# Altium schematic sheet 25632-myersd33_02_7459.SchDoc: MSP430 Booster Pack
size B; Date: Not shown in title block; ApprovedBy: Not shown in title block; CheckedBy: Not shown in title block; Author: Not shown in title block; CompanyName: Not shown in title block; Engineer: Logan Greif; Organization: Not shown in title block; Address1: Not shown in title block; Address2: Not shown in title block; Address3: Not shown in title block; Address4: Not shown in title block; DocumentNumber: 1; Revision: Use project parameter SCH_Rev; SheetNumber: 1; SheetTotal: 2; PageSetup: Record=PageOptions|CenterHorizontal=True|CenterVertical=True|PrintScale=1.00|XCorrection=1.00|YCorrection=1.00|PrintKind=0|BorderSize=5000000|LeftOffset=0|BottomOffset=0|Orientation=2|PaperLength=1000|PaperWidth=1000|Scale=100|PaperSource=15|PrintQuality=600|MediaType=1|DitherType=10|PaperKind=Letter|PrintScaleMode=1; SPICEModelCacheLYYKNJCK: <root> / <DocumentId>LYYKNJCK</DocumentId> / </root>; CurrentTime: Not shown in title block; CurrentDate: Not shown in title block; Time: Not shown in title block; DocumentFullPathAndName: Not shown in title block; DocumentName: Not shown in title block; ModifiedDate: Not shown in title block; ImagePath: Not shown in title block
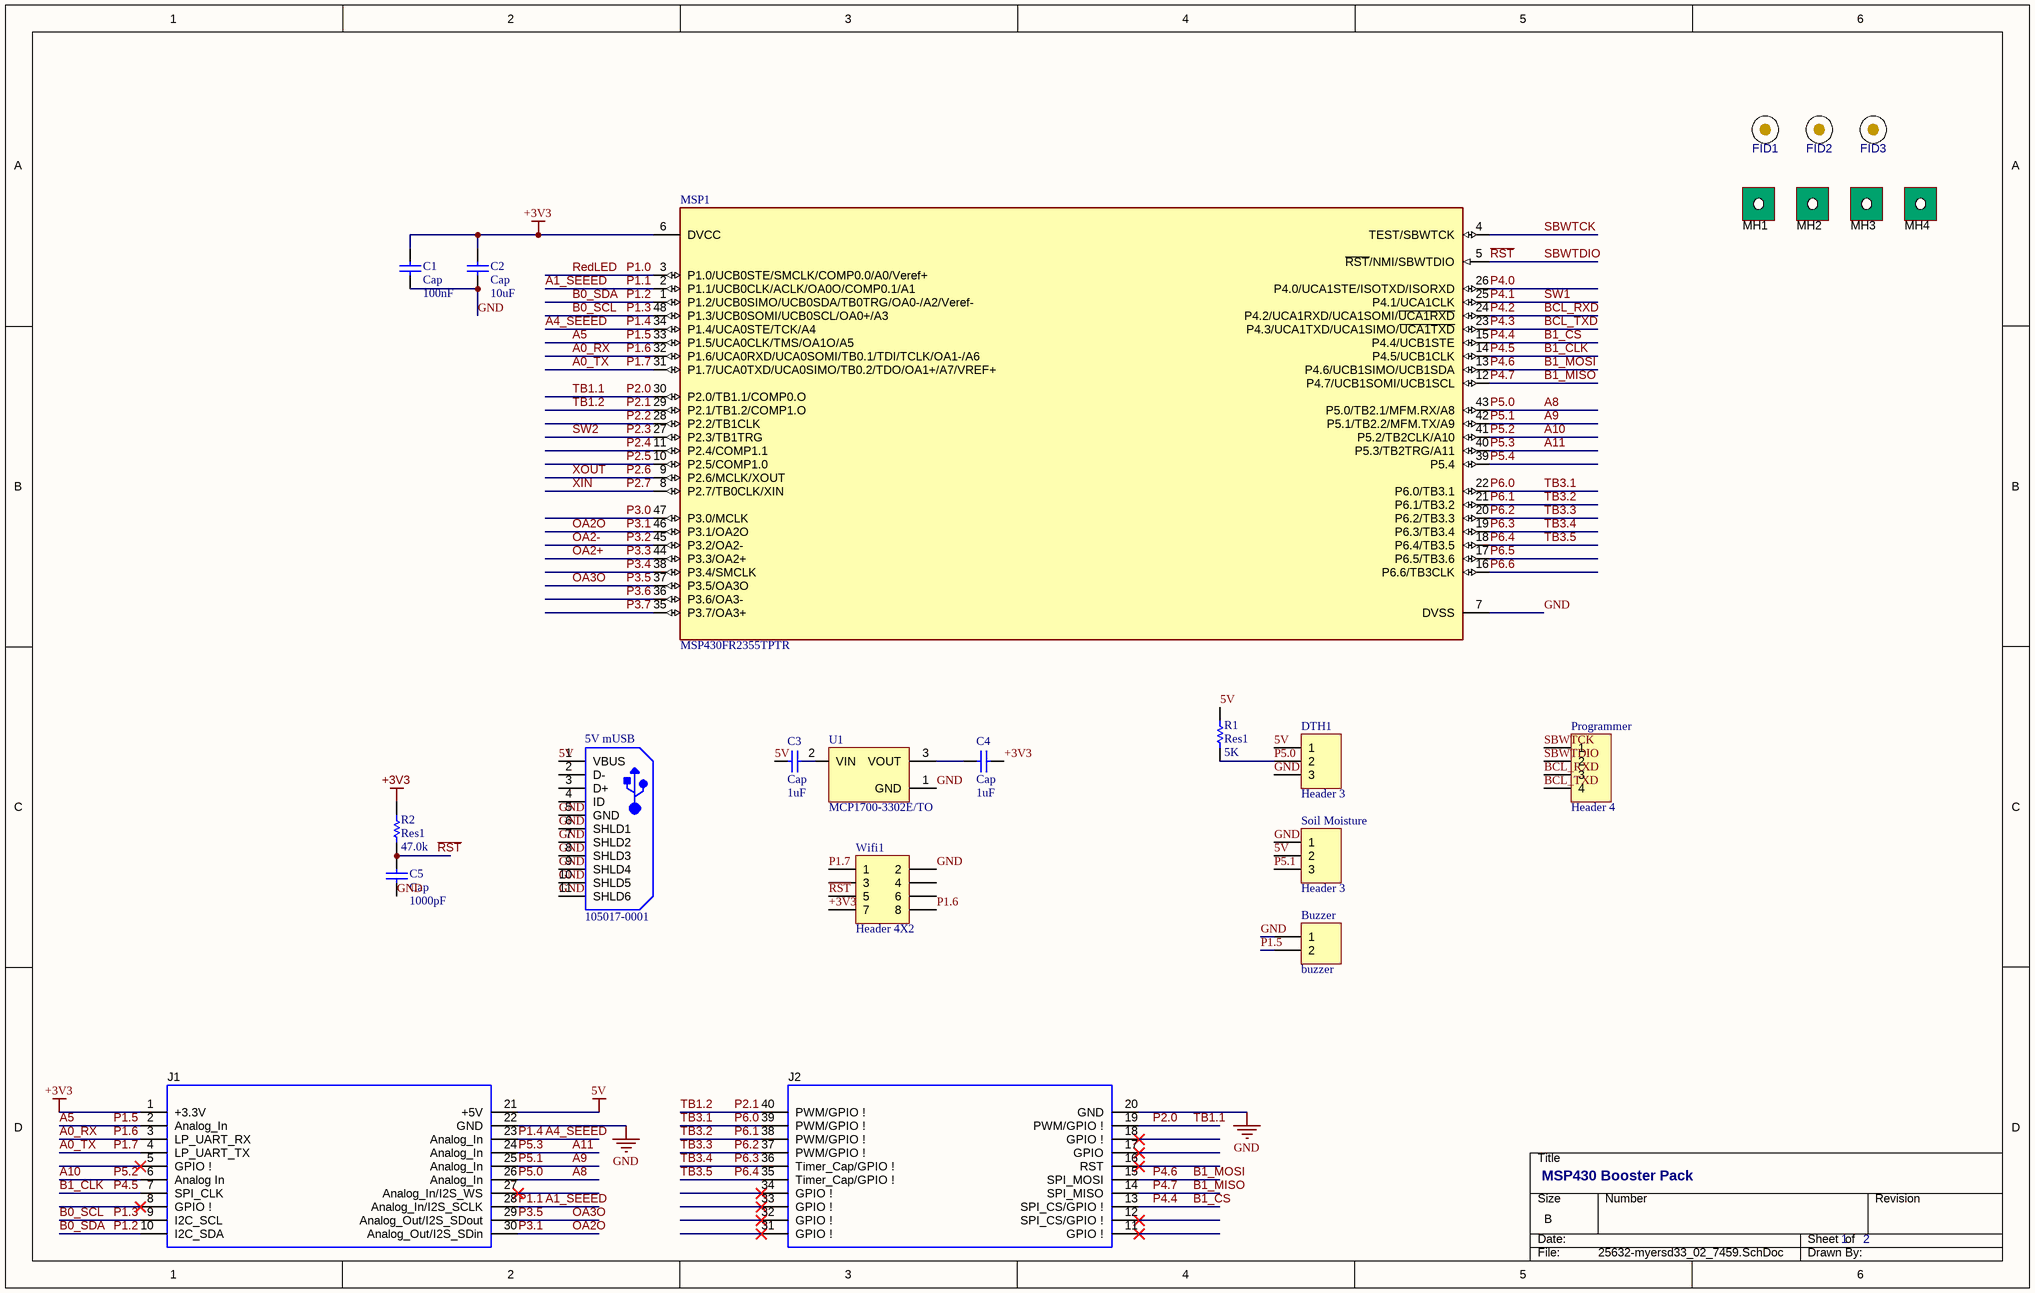
[diagram p0: 25632-myersd33_02_7459.SchDoc]

## Parts
5V_mUSB  105017-0001  [USB-MICRO-B_V]
Buzzer  buzzer  [HDR1X2]
C1  Cap  value 100nF  [RAD-0.3]
C2  Cap  value 10uF  [RAD-0.3]
C3  Cap  value 1uF  [RAD-0.3]
C4  Cap  value 1uF  [RAD-0.3]
C5  Cap  value 1000pF  [RAD-0.3]
DTH1  Header 3  [HDR1X3]
FID1  Fiducial  [Fiducial6.4-20]  (value not drawn)
FID2  Fiducial  [Fiducial6.4-20]  (value not drawn)
FID3  Fiducial  [Fiducial6.4-20]  (value not drawn)
J1  SSQ-110-03-T-D  [BoosterPack_40pin_J1J3]  (value not drawn)
J2  SSQ-110-03-T-D  [BoosterPack_40pin_J2J4]  (value not drawn)
MH1  MTG_NoPads  [NPTH125mil]  (value not drawn)  (no BOM)
MH2  MTG_NoPads  [NPTH125mil]  (value not drawn)  (no BOM)
MH3  MTG_NoPads  [NPTH125mil]  (value not drawn)  (no BOM)
MH4  MTG_NoPads  [NPTH125mil]  (value not drawn)  (no BOM)
MSP1  MSP430FR2355TPTR  [FP-PT0048A-MFG]
Programmer  Header 4  [HDR1X4]
R1  Res1  value 5K  [AXIAL-0.3]
R2  Res1  value 47.0k  [AXIAL-0.3]
Soil_Moisture  Header 3  [HDR1X3]
U1  MCP1700-3302E/TO  [TO-92-TO3]
Wifi1  Header 4X2  [HDR2X4]

## Nets
5V: 5V_mUSB.1(VBUS) C3.1 DTH1.1 J1.21(+5V) R1.2 Soil_Moisture.2
+3V3: C1.2 C2.2 C4.2 J1.1(+3.3V) MSP1.6(DVCC) R2.2 Wifi1.7
GND: 5V_mUSB.5(GND) 5V_mUSB.6(SHLD1) 5V_mUSB.7(SHLD2) 5V_mUSB.8(SHLD3) 5V_mUSB.9(SHLD4) 5V_mUSB.10(SHLD5) 5V_mUSB.11(SHLD6) Buzzer.1 C1.1 C2.1 C5.1 DTH1.3 J1.22(GND) J2.20(GND) MSP1.7(DVSS) Soil_Moisture.1 U1.1(GND) Wifi1.2
A0_RX: J1.3(LP_UART_RX) MSP1.32(P1.6/UCA0RXD/UCA0SOMI/TB0.1/TDI/TCLK/OA1-/A6) Wifi1.8  [also labelled P1.6]
A0_TX: J1.4(LP_UART_TX) MSP1.31(P1.7/UCA0TXD/UCA0SIMO/TB0.2/TDO/OA1+/A7/VREF+) Wifi1.1  [also labelled P1.7]
A1_SEEED: J1.28(Analog_In/I2S_SCLK) MSP1.2(P1.1/UCB0CLK/ACLK/OA0O/COMP0.1/A1)  [also labelled P1.1]
A4_SEEED: J1.23(Analog_In) MSP1.34(P1.4/UCA0STE/TCK/A4)  [also labelled P1.4]
A5: Buzzer.2 J1.2(Analog_In) MSP1.33(P1.5/UCA0CLK/TMS/OA1O/A5)  [also labelled P1.5]
A8: DTH1.2 J1.26(Analog_In) MSP1.43(P5.0/TB2.1/MFM.RX/A8) R1.1  [also labelled P5.0]
A9: J1.25(Analog_In) MSP1.42(P5.1/TB2.2/MFM.TX/A9) Soil_Moisture.3  [also labelled P5.1]
A10: J1.6(Analog_In) MSP1.41(P5.2/TB2CLK/A10)  [also labelled P5.2]
A11: J1.24(Analog_In) MSP1.40(P5.3/TB2TRG/A11)  [also labelled P5.3]
B0_SCL: J1.9(I2C_SCL) MSP1.48(P1.3/UCB0SOMI/UCB0SCL/OA0+/A3)  [also labelled P1.3]
B0_SDA: J1.10(I2C_SDA) MSP1.1(P1.2/UCB0SIMO/UCB0SDA/TB0TRG/OA0-/A2/Veref-)  [also labelled P1.2]
B1_CLK: J1.7(SPI_CLK) MSP1.14(P4.5/UCB1CLK)  [also labelled P4.5]
B1_CS: J2.13(SPI_CS/GPIO_!) MSP1.15(P4.4/UCB1STE)  [also labelled P4.4]
B1_MISO: J2.14(SPI_MISO) MSP1.12(P4.7/UCB1SOMI/UCB1SCL)  [also labelled P4.7]
B1_MOSI: J2.15(SPI_MOSI) MSP1.13(P4.6/UCB1SIMO/UCB1SDA)  [also labelled P4.6]
BCL_RXD: MSP1.24(P4.2/UCA1RXD/UCA1SOMI/~{UCA1RXD}) Programmer.3  [also labelled P4.2]
BCL_TXD: MSP1.23(P4.3/UCA1TXD/UCA1SIMO/~{UCA1TXD}) Programmer.4  [also labelled P4.3]
OA2+: MSP1.44(P3.3/OA2+)  [also labelled P3.3]
OA2-: MSP1.45(P3.2/OA2-)  [also labelled P3.2]
OA2O: J1.30(Analog_Out/I2S_SDin) MSP1.46(P3.1/OA2O)  [also labelled P3.1]
OA3O: J1.29(Analog_Out/I2S_SDout) MSP1.37(P3.5/OA3O)  [also labelled P3.5]
P1.0: MSP1.3(P1.0/UCB0STE/SMCLK/COMP0.0/A0/Veref+)  [also labelled RedLED]
P2.0: J2.19(PWM/GPIO_!) MSP1.30(P2.0/TB1.1/COMP0.O)  [also labelled TB1.1]
P2.1: J2.40(PWM/GPIO_!) MSP1.29(P2.1/TB1.2/COMP1.O)  [also labelled TB1.2]
P2.2: MSP1.28(P2.2/TB1CLK)
P2.3: MSP1.27(P2.3/TB1TRG)  [also labelled SW2]
P2.4: MSP1.11(P2.4/COMP1.1)
P2.5: MSP1.10(P2.5/COMP1.0)
P2.6: MSP1.9(P2.6/MCLK/XOUT)  [also labelled XOUT]
P2.7: MSP1.8(P2.7/TB0CLK/XIN)  [also labelled XIN]
P3.0: MSP1.47(P3.0/MCLK)
P3.4: MSP1.38(P3.4/SMCLK)
P3.6: MSP1.36(P3.6/OA3-)
P3.7: MSP1.35(P3.7/OA3+)
P4.0: MSP1.26(P4.0/UCA1STE/ISOTXD/ISORXD)
P4.1: MSP1.25(P4.1/UCA1CLK)  [also labelled SW1]
P5.4: MSP1.39(P5.4)
P6.0: J2.39(PWM/GPIO_!) MSP1.22(P6.0/TB3.1)  [also labelled TB3.1]
P6.1: J2.38(PWM/GPIO_!) MSP1.21(P6.1/TB3.2)  [also labelled TB3.2]
P6.2: J2.37(PWM/GPIO_!) MSP1.20(P6.2/TB3.3)  [also labelled TB3.3]
P6.3: J2.36(Timer_Cap/GPIO_!) MSP1.19(P6.3/TB3.4)  [also labelled TB3.4]
P6.4: J2.35(Timer_Cap/GPIO_!) MSP1.18(P6.4/TB3.5)  [also labelled TB3.5]
P6.5: MSP1.17(P6.5/TB3.6)
P6.6: MSP1.16(P6.6/TB3CLK)
~{RST}: C5.2 MSP1.5(~{RST}/NMI/SBWTDIO) Programmer.2 R2.1 Wifi1.5  [also labelled SBWTDIO]
SBWTCK: MSP1.4(TEST/SBWTCK) Programmer.1
NetC3_2: C3.2 U1.2(VIN)
NetC4_1: C4.1 U1.3(VOUT)

Not connected (* = marked no-connect by the designer): 5V_mUSB 2(D-) 3(D+) 4(ID); J1 5(GPIO_!)* 8(GPIO_!)* 27(Analog_In/I2S_WS)*; J2 11(GPIO_!)* 12(SPI_CS/GPIO_!)* 16(RST)* 17(GPIO)* 18(GPIO_!)* 31(GPIO_!)* 32(GPIO_!)* 33(GPIO_!)* 34(GPIO_!)*; Wifi1 3 4 6

## Notes on the sheet
- DWG. NO.
- REV.
- SHT.
- REVISION
- DESCRIPTION
- DATE
- APPROVED
- THIS DOCUMENT AND THE DATA DISCLOSED HEREIN OR HEREWITH IS THE PROPERTY OF ALTIUM LIMITED AND MAY BE FREELY DISTRIBUTED IN WHOLE. NO RIGHTS ARE RESERVED OR EXPRESS OR IMPLIED WARANTEE GIVEN.
- ENG:
- DSN:
- APPROVALS
- PROJECT
- DOCUMENT REVISION:
- DESIGN ITEM:
- CHK:
- BOM:
- REFERENCE DOCUMENTS
- PROJECT REVISION:
- TITLE
- FAB DWG:
- PCB DWG:
- ASSY DWG:
- SCALE:
- SIZE
- C
- CAGE CODE
- FILE NAME
- DWG NO.
- SHEET
- OF
- REV

## Library data of the parts
5V_mUSB = CMP-2000-05827-1: Micro-USB B Receptacle, Right Angle, Bottom Mount, Surface Mount, with Solder Tabs, -30 to 85 degC, 5-Pin USB, RoHS, Tape and Reel; Manufacturer: Molex; Featured Product: Micro-USBConnectorsUSBConnectors; Other Names: WM1399DKR; Package Version: Rev. F, 12/2012; Number of Contacts: 5; Connector Type: USB-microB; Catalog Drawings: 1050170001; 3D Model: 105017-0001.stp; Mating Products: WM17145-ND-CABLEMICROUSBBTOSTDA1.0MWM17147-ND-CABLEMICROUSBBTOSTDA2.0MWM17146-ND-CABLEMICROUSBBTOSTDA1.5M; PCN Assembly/Origin: ResinSupplier21/Oct/2015; Voltage - Max: 30V; Online Catalog: Molex-MicroUSB; Manufacturer URL: http://www.molex.com/; Package Description: 5-Leads USB, Micro B, Body 7.5 x 5 mm, Pitch 0.65 mm; Datasheet URL: http://www.molex.com/elqNow/elqRedir.htm?ref=http://www.molex.com/webdocs/datasheets/pdf/en-us/1050170001_IO_CONNECTORS.pdf; Ingress Protection: -; Datasheet Version: 03/2016; Mounting Type: BoardCutout,SurfaceMount,RightAngle; Circuits: 5; Standard Package: 1; Package Reference: MICRO-B; Package URL: http://www.molex.com/pdm_docs/sd/1050170001_sd.pdf; Category: Connectors,Interconnects; Series: -; RoHS Information: 1050170001CertofCompliance; Features: Shielded,SolderRetention; Family: USB,DVI,HDMIConnectors; Specifications: -; Gender: Receptacle; Packaging: Digi-Reel®; Mounting Technology: SurfaceMount
Buzzer = Header 2: Header, 2-Pin; LatestRevisionDate: 17-Jul-2002; LatestRevisionNote: Re-released for DXP Platform.; Publisher: Altium Limited
C1-C5 = Cap: Capacitor; Published: 8-Jun-2000; LatestRevisionDate: 17-Jul-2002; LatestRevisionNote: Re-released for DXP Platform.; PackageReference: RAD-0.3; Publisher: Altium Limited; PackageDescription: Radial Cap, Thru-Hole; 2 Leads; 0.3 in Pin Spacing
DTH1 Soil_Moisture = Header 3: Header, 3-Pin; LatestRevisionDate: 17-Jul-2002; LatestRevisionNote: Re-released for DXP Platform.; Publisher: Altium Limited
FID1-FID3 = Fiducial: Fiducial mark.  There is nothing to buy or mount.; SymbolCreator: codlsc; SymbolVersion: 2009-11-4; CompType: Fiducial; PackageReference: N/A; ClassName: FiducialMark; Manufacturer: N/A; PartNumber: N/A; MountType: N/A; Publisher: Texas Instruments; LatestRevisionDate: 2017-05-31; LatestRevisionNote: Added Alternate PartNumber and Alternate Manufacturer parameters to appropriate components.
J1 = BoosterPack_40pin_J1J3: Receptacle, 2.54mm, 10x2, Tin, TH; Manufacturer: Samtec; Alternate Manufacturer: Major League Electronics; Alternate PartNumber: CRD-081413-A-G; SymbolCreator: a0412235; Note: Booster Pack 40 pin J1 and J3; SymbolVersion: 2015-10-21; CompType: Receptacle; PartNumber: SSQ-110-03-T-D; RoHS: Y; PackageReference: 10x2 Receptacle; MountType: TH; ComponentLink1Description: Datasheet Link; Publisher: Texas Instruments; LatestRevisionDate: 2017-02-01; Supplier 1: Digi-Key; Supplier Part Number 1: SAM1204-10-ND
J2 = BoosterPack_40pin_J2J4: Receptacle, 2.54mm, 10x2, Tin, TH; Manufacturer: Samtec; Alternate Manufacturer: Major League Electronics; Alternate PartNumber: CRD-081413-A-G; SymbolCreator: a0412235; Note: Booster Pack 40 pin J2 and J4; SymbolVersion: 2015-10-21; CompType: Receptacle; PartNumber: SSQ-110-03-T-D; RoHS: Y; PackageReference: 10x2 Receptacle; MountType: TH; ComponentLink1Description: Datasheet Link; Publisher: Texas Instruments; LatestRevisionDate: 2017-02-01; Supplier 1: Digi-Key; Supplier Part Number 1: SAM1204-10-ND
MH1-MH4 = Mounting Hole (non-standard) No Pad: PCB Mounting Hole, No Pad; Manufacturer: Any; SymbolCreator: a0412235; SymbolVersion: 2013-12-26; CompType: Mounting Hole; PartNumber: N/A; PackageReference: Mounting Hole; MountType: N/A; Publisher: Texas Instruments; LatestRevisionDate: 2017-01-25
MSP1 = CMP-04869-000010-1: IC MCU 16BIT 32KB FRAM 48LQFP; Manufacturer: Texas Instruments; Frequency: 24MHz; Ram Size: 4KBytes; Memory Type: OTHER; Max Junction Temp: +115°C; Standoff Height: 0.05mm; Data Bus Width: 16bits; Number Of Uart Channels: 2; Number Of Cores: 1; Memory Size: 32KBytes; Core Architecture: RISC; Number Of Spi Channels: 4; Max Supply Voltage: 3.6V; Number Of I/Os: 44; Interface: I2C,SPI,UART,USART,SCI,IrDA; Min Supply Voltage: 1.8V; Number Of Adc Channels: 12; Ipc Land Pattern Name: QFP50P900X900X160-48; Lead Free: Yes; Device Class L1: Integrated Circuits (ICs); Digikey Description: IC MCU 16BIT 32KB FRAM 48LQFP; Manufacturer Part Number: MSP430FR2355TPTR; Height: 1.6mm; Number Of Timers/Counters: 4; RoHS: TRUE; Temperature Range High: +105°C; Temperature: -40°C to +105°C; Temperature Range Low: -40°C; Automotive: No; Number Of A/D Converters: 1; Device Class L3: Microcontrollers; ComponentLink2URL: http://www.ti.com/lit/ds/symlink/msp430fr2355.pdf; Octopart: https://octopart.com/msp430fr2355tptr-texas+instruments-92191342; Device Class L2: Embedded Processors and Controllers; Package: PT0048A; Ambient Temperature Range Low: -40°C; Category: IC; Footprint Url: http://www.ti.com/lit/ds/symlink/tl16c550c.pdf; Ambient Temperature Range High: +105°C; Number Of I2C Channels: 2; ComponentLink2Description: Datasheet
Programmer = Header 4: Header, 4-Pin; LatestRevisionDate: 17-Jul-2002; LatestRevisionNote: Re-released for DXP Platform.; Publisher: Altium Limited
R1 R2 = Res1: Resistor; Published: 8-Jun-2000; LatestRevisionDate: 17-Jul-2002; LatestRevisionNote: Re-released for DXP Platform.; PackageReference: AXIAL-0.3; Publisher: Altium Limited; PackageDescription: Axial Device, Thru-Hole; 2 Leads; 0.3 in Pin Spacing
U1 = CMP-0136-00007-1: Low Quiescent Current LDO, 3-Pin TO-92, Extended TemperatureBAG; PackageReference: TO-92-TO3; PackageDescription: 3-Lead Plastic Transistor Outline (TO) [TO-92]; DatasheetVersion: revB, Feb-2007; PackageVersion: revBB, Aug-2009
Wifi1 = Header 4X2: Header, 4-Pin, Dual row; LatestRevisionDate: 17-Jul-2002; LatestRevisionNote: Re-released for DXP Platform.; Publisher: Altium Limited